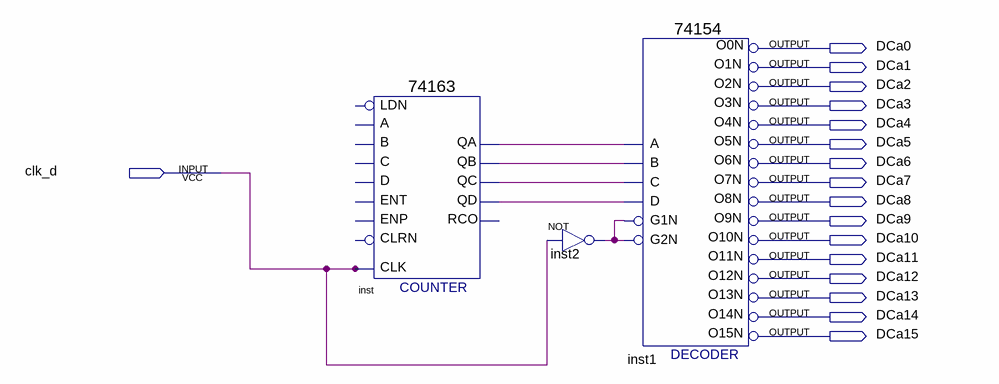
[diagram p0: schematic sheet]
// Quartus schematic Block3.bdf as structural Verilog: 3 symbols, 17 pins
module Block3 (
  input  clk_d,
  output DCa0,
  output DCa1,
  output DCa2,
  output DCa3,
  output DCa4,
  output DCa5,
  output DCa6,
  output DCa7,
  output DCa8,
  output DCa9,
  output DCa10,
  output DCa11,
  output DCa12,
  output DCa13,
  output DCa14,
  output DCa15
);

  wire inst2_out, inst_qa, inst_qb, inst_qc, inst_qd;

  \74163  inst (
    .CLK(clk_d), .QA(inst_qa), .QB(inst_qb), .QC(inst_qc), .QD(inst_qd));  // open: C, B, A, ENT, D, CLRN, ENP, LDN, RCO
  not inst2 (inst2_out, clk_d);
  \74154  inst1 (
    .C(inst_qc), .D(inst_qd), .B(inst_qb), .A(inst_qa), .G1N(inst2_out), .G2N(inst2_out), .O0N(DCa0),
    .O12N(DCa12), .O15N(DCa15), .O10N(DCa10), .O11N(DCa11), .O1N(DCa1), .O13N(DCa13), .O14N(DCa14),
    .O4N(DCa4), .O3N(DCa3), .O2N(DCa2), .O7N(DCa7), .O6N(DCa6), .O5N(DCa5), .O9N(DCa9), .O8N(DCa8));
endmodule
